# EasyEDA Pro project ProPrj_Dolphin 3D.epro, board PCB2
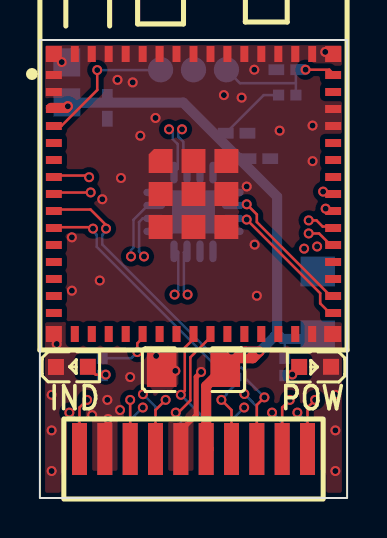
[diagram p5: board, top side]
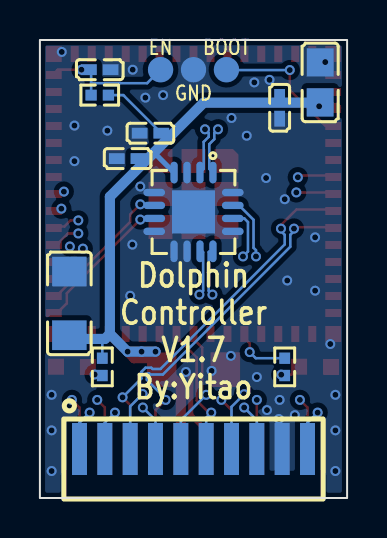
[diagram p6: board, bottom side, seen from below]

Outline 15.4 x 22.9 mm; copper layers: Top Layer, Inner1, Inner2, Bottom Layer. Coordinates in mm from the lower left corner of the outline.
Outline path: rectangle 0,22.9 15.4,0
Stack: Top Layer 0.035mm 外层铜厚1oz / Dielectric1 0.2133mm 7628 RC49% 8.6mil / Inner1 0.035mm 内层铜厚 / Dielectric2 0.2133mm 1.1mm H/HOZ 含铜 / Inner2 0.035mm 内层铜厚 / Dielectric3 0.2133mm 7628 RC49% 8.6mil / Bottom Layer 0.035mm 外层铜厚1oz

## Design rules (mm)
net D+: D
net D-: D
net M2B: M2
net M2A: M2
net M2EB: M2E
net M2EA: M2E
net M1A: M1
net M1B: M1
net M1EA: M1E
net M1EB: M1E
net VM1-: VM1
net VM1+: VM1
net VM2-: VM2
net VM2+: VM2
net VB-: VB
net VB+: VB
template: 自定义配置
spacing copperThickness1oz (default): track to track 0.102, other pairs 0 to 0.3
spacing copperThickness2oz: track to track 0.203, other pairs 0.152 to 0.3
track width copperThickness1oz (default): min 0.127, default 0.254, max 2.54
track width copperThickness2oz: min 0.203, default 0.254, max 2.54
differential pair differentialPair (default): width min 0.127, default 0.254, max 2.54; gap min 0.152, default 0.152
via viaSize (default): diameter min 0.5, default 0.61, max 10; hole min 0.3, default 0.305, max 6.299

## Placement (name value [footprint] x y rotation side)
C6  100uF  [C1206]  7.7 6.42 0 top
C7  22uF  [C0805]  1.35 20.78 270 bottom
C8  100nF  [C0402]  3.38 19.51 90 bottom
C16  1uF  [C0402]  12.4 21.42 180 bottom
C17  100nF  [C0402]  11 16.97 180 bottom
C18  1uF  [C0402]  9.86 18.24 180 bottom
C19  100uF  [C1206]  13.92 9.73 270 bottom
H1  KH-1.27PH180-2X10P-L7.2  [KH-1.27PH180-2X10P-L7.2 夹板]  7.7 2.45 180 bottom
LED1  KT-0603R  [LED0603-RD]  13.8 6.56 180 top
LED2  KT-0603W  [LED0603-RD]  1.6 6.56 0 top
NOREF  -  [Pad_e1005]  7.7 21.42 0 top
R3  1kΩ  [R0402]  12.4 20.14 180 bottom
R8  1kΩ  [R0402]  12.27 6.56 90 bottom
R9  1kΩ  [R0402]  3.13 6.56 90 bottom
TP1  -  [test-point-0.5mm]  6.05 21.42 0 top
TP2  -  [test-point-0.5mm]  9.35 21.42 0 top
U1  2.4GHz  [WIFI-SMD_ESP32-MINI-1-N4]  7.7 15.2 0 top
U7  INA3221AIRGVR  [QFN-16_L4.0-W4.0-P0.65-TL-EP2.2]  7.7 14.3 270 bottom

## Footprints (pads in the part's own frame, mm; a bottom-side part is the same pattern mirrored in y, then rotated)
C0402
  rect 0.79x0.54 smd: 1(-0.545,0) 2(0.545,0)
C0805
  rect 1.41x1.35 smd: 1(-1,0) 2(1,0)
C1206
  rect 1.485x1.728 smd: 1(-1.593,0) 2(1.593,0)
KH-1.27PH180-2X10P-L7.2 夹板
  rect 0.75x2.6 smd: 1(-5.715,0) 3(-4.445,0) 5(-3.175,0) 7(-1.905,0) 9(-0.635,0) 11(0.635,0) 13(1.905,0) 15(3.175,0) 17(4.445,0) 19(5.715,0)
  rect 0.75x2.6 smd far side: 2(-5.715,0) 4(-4.445,0) 6(-3.175,0) 8(-1.905,0) 10(-0.635,0) 12(0.635,0) 14(1.905,0) 16(3.175,0) 18(4.445,0) 20(5.715,0)
LED0603-RD
  rect 0.8x0.8 smd: 1(-0.799,-0.004) 2(0.799,0.004)
Pad_e1005
  round 1.27 smd far side: TP1(0,0)
QFN-16_L4.0-W4.0-P0.65-TL-EP2.2
  oval 1.087x0.364 smd: 1(-1.968,0.975) 2(-1.968,0.325) 3(-1.968,-0.325) 4(-1.968,-0.975) 9(1.968,-0.975) 10(1.968,-0.325) 11(1.968,0.325) 12(1.968,0.975)
  oval 0.364x1.087 smd: 5(-0.975,-1.968) 6(-0.325,-1.968) 7(0.325,-1.968) 8(0.975,-1.968) 13(0.975,1.968) 14(0.325,1.968) 15(-0.325,1.968) 16(-0.975,1.968)
  rect 2.16x2.16 smd: 17(0,0)
R0402
  rect 0.566x0.54 smd: 1(-0.433,0) 2(0.433,0)
test-point-0.5mm
  round 1.27 smd far side: 1(0,0)
WIFI-SMD_ESP32-MINI-1-N4
  rect 0.8x0.4 smd: 1(-7,5.95) 2(-7,5.1) 3(-7,4.25) 4(-7,3.4) 5(-7,2.55) 6(-7,1.7) 7(-7,0.85) 8(-7,0.001) 9(-7,-0.85) 10(-7,-1.7) 11(-7,-2.55) 12(-7,-3.4) 13(-7,-4.25) 14(-7,-5.1) 15(-7,-5.949) 31(7,-5.95) 32(7,-5.1) 33(7,-4.25) 34(7,-3.4) 35(7,-2.55) 36(7,-1.7) 37(7,-0.85) 38(7,-0.001) 39(7,0.85) 40(7,1.7) 41(7,2.55) 42(7,3.4) 43(7,4.25) 44(7,5.1) 45(7,5.949)
  rect 0.4x0.8 smd: 16(-5.95,-7) 17(-5.1,-7) 18(-4.25,-7) 19(-3.4,-7) 20(-2.55,-7) 21(-1.7,-7) 22(-0.85,-7) 23(-0.001,-7) 24(0.85,-7) 25(1.7,-7) 26(2.55,-7) 27(3.4,-7) 28(4.25,-7) 29(5.1,-7) 30(5.949,-7) 46(5.95,7) 47(5.1,7) 48(4.25,7) 49(3.4,7) 50(2.55,7) 51(1.7,7) 52(0.85,7) 53(0,7) 54(-0.85,7) 55(-1.7,7) 56(-2.55,7) 57(-3.4,7) 58(-4.25,7) 59(-5.1,7) 60(-5.95,7)
  custom 1.2x1.2 smd: 61(-1.65,1.65)
  rect 1.2x1.2 smd: 61(-1.65,0) 61(-1.65,-1.65) 61(0,1.65) 61(0,0) 61(0,-1.65) 61(1.649,-1.65) 61(1.65,1.65) 61(1.65,0)
  rect 0.8x0.8 smd: 62(-7,7) 63(-7,-7) 65(7,7)
  rect 0.85x0.8 smd: 64(6.975,-7)

## Nets
As in the schematic, except:
GND: C6.1 C7.1 C8.1 C16.2 C17.1 C18.1 C19.1 H1.12 H1.17 H1.18 LED1.1 LED2.1 NOREF.TP1 U1.1 U1.2 U1.30 U1.42 U1.43 U1.46 U1.47 U1.48 U1.49 U1.50 U1.51 U1.52 U1.53 U1.54 U1.55 U1.56 U1.57 U1.58 U1.59 U1.60 U1.61 U1.62 U1.63 U1.64 U1.65 U7.3 U7.5 U7.8 U7.9 U7.10 U7.13 U7.16 U7.17

Pads without a net: U1 6 11 12 13 14 15 16 17 18 19 21 22 25 26 27 28 29 33 34 39 40 41 44

## Via types
v1: diameter 0.5, hole 0.3, Top Layer to Bottom Layer, 78 vias

## Routing (per net, layer and track width the routed paths; a pad name or vN(x,y) marks a point on that pad's centre or on a via; arc(x,y) is an arc through that point)
+3V3: length 38.5
  Top Layer w0.508: 8.46,2.45 8.33,2.58 8.33,5.6 9.73,6.99 10.67,6.99 v1(11,7.32) v1(10.3,7.32) v1(9.6,7.32) ; 0.55,19.5 1.32,19.5 v1(1.4,19.59)
  Bottom Layer w0.127: R8.2 12.27,7.83 12.14,7.95 ; C18.2 11.22,20.14 R3.2
  Bottom Layer w0.254: 9.73,17.22 9.63,17.22 U7.4
  Bottom Layer w0.508: v1(9.6,7.32) v1(10.3,7.32) v1(11,7.32) 11.89,8.21 ; 11.89,8.21 12.14,7.95 13.47,7.95 ; 11.89,8.21 11.89,15.06 9.73,17.22 9.73,17.22 9.73,17.22 7.19,19.77 1.58,19.77 v1(1.4,19.59)
GND: length 4.3
  Top Layer w0.254: H1.12 7.06,3.38 7.83,4.14 7.83,6.06 v1(8.08,6.3)
  vias: v1(0.59,5.16) v1(0.59,3.38) v1(0.59,1.35) v1(0.84,7.7) v1(1.1,21.8) v1(1.6,13.03) v1(1.6,10.37) v1(2.62,4.14) v1(3,10.87) v1(3.13,14.94) v1(3.38,4.91) v1(3.42,3.95) v1(3.89,20.91) v1(4.02,4.4) v1(4.06,16) v1(4.52,6.05) v1(4.65,20.78) v1(5.03,18.11) v1(5.79,19) v1(5.83,7.11) v1(6.79,6.36) v1(9.22,20.14) v1(10.11,20.02) v1(10.37,15.57) v1(10.75,21.42) v1(10.76,12.67) v1(10.88,10.11) v1(12.02,18.37) v1(13.67,18.62) v1(13.67,16.84) v1(14.3,22.3) v1(14.81,5.16) v1(14.81,3.38) v1(14.81,1.35)
BOOT: length 7.1
  Top Layer w0.127: v1(2.87,21.4) 2.87,20.4 1.1,18.62 0.75,18.62 0.7,18.67
  Bottom Layer w0.127: v1(2.87,21.4) 6.03,21.4 TP1.1
D+: length 6.7
  Top Layer w0.127: 8.55,8.27 8.55,8.04 7.54,7.03 7.54,4.87 6.94,4.27 v1(6.81,4.27)
  Bottom Layer w0.127: H1.11 7.06,4.02 v1(6.81,4.27)
D-: length 6.7
  Top Layer w0.127: v1(7.06,5.16) 7.26,5.36 7.26,7.52 7.7,7.95 7.7,8.33
  Bottom Layer w0.127: H1.9 8.33,3.89 v1(7.06,5.16)
EN: length 6.5
  Top Layer w0.127: 14.7,21.22 14.51,21.42 v1(13.32,21.42)
  Bottom Layer w0.127: R3.1 12.83,20.74 ; 12.83,20.74 12.83,21.3 C16.1 ; 12.83,20.74 10.03,20.74 TP2.1
LED: length 2.9
  Top Layer w0.127: U1.20 5.15,8 4.88,7.73 v1(4.88,7.3)
  Bottom Layer w0.127: R9.2 4.58,6.99 v1(4.88,7.3)
M1A: length 17.5
  Top Layer w0.127: H1.14 5.79,4.4 v1(6.3,4.91) ; 0.7,16.12 2.38,16.12 v1(2.47,16.04)
  Inner2 w0.127: v1(2.47,16.04) 3.08,16.04 4.1,15.02 4.1,7.42 6.3,5.22 v1(6.3,4.91)
M1B: length 16.2
  Top Layer w0.127: 0.7,15.27 2.54,15.27 v1(2.55,15.28) ; v1(4.52,4.91) H1.16
  Inner2 w0.127: v1(4.52,4.91) 3.82,5.61 3.82,14.9 3.28,15.45 2.71,15.45 v1(2.55,15.28)
M1EA: length 18.3
  Top Layer w0.127: 0.7,14.42 2.54,14.42 3.31,13.65 v1(3.31,13.47) ; v1(11.26,5.03) 10.88,4.65 H1.6
  Bottom Layer w0.127: v1(3.31,13.47) 3.31,13.35 3.13,13.16 3.13,12.68 9.35,6.45 9.75,6.45 9.81,6.51 10.11,6.51 10.32,6.3 10.32,5.97 v1(11.26,5.03)
M1EB: length 17.1
  Top Layer w0.127: H1.8 9.6,4.4 v1(9.1,4.91) ; 0.76,13.54 2.59,13.54 v1(2.66,13.47)
  Bottom Layer w0.127: v1(2.66,13.47) 2.66,13.35 2.85,13.16 2.85,12.56 9.24,6.17 9.87,6.17 9.93,6.23 9.99,6.23 10.04,6.19 10.04,5.91 9.35,5.22 9.35,5.16 v1(9.1,4.91)
M2A: length 14.1
  Inner1 w0.127: v1(13.9,12.57) 14.09,12.38 14.09,9.23 10.72,5.86 10.72,5 v1(10.24,4.52)
  Inner2 w0.127: v1(14.32,14.47) 14.32,13 v1(13.9,12.57)
  Bottom Layer w0.127: v1(10.24,4.52) 9.6,3.89 H1.7
M2B: length 15.5
  Inner1 w0.127: v1(13.24,12.47) 13.81,11.9 13.81,9.35 10.25,5.79 v1(10.25,5.2)
  Inner2 w0.127: v1(13.24,12.47) 12.91,12.81 12.91,13.97 14.2,15.26 v1(14.2,15.32)
  Bottom Layer w0.127: v1(10.25,5.2) 10.88,4.58 H1.5
M2EA: length 16.3
  Top Layer w0.127: 14.7,12.72 14.5,12.72 14,13.23 v1(13.47,13.23)
  Inner1 w0.127: v1(5.16,4.52) 5.64,5 5.64,5.86 13.19,13.41 13.29,13.41 v1(13.47,13.23)
  Bottom Layer w0.127: v1(5.16,4.52) 4.52,3.89 H1.15
M2EB: length 16.6
  Top Layer w0.127: 14.7,13.57 14.17,13.57 13.87,13.88 v1(13.47,13.88)
  Inner1 w0.127: v1(13.47,13.88) 13.29,13.69 13.07,13.69 5.36,5.98 5.36,5.8 5.16,5.6 v1(5.16,5.19)
  Bottom Layer w0.127: H1.13 5.79,4.56 v1(5.16,5.19)
SCL: length 6.4
  Top Layer w0.127: v1(10.37,14.68) 10.88,14.18 10.88,13.8 14.5,10.17 14.7,10.17
SDA: length 6.5
  Top Layer w0.127: 14.7,9.32 14.46,9.32 14.05,9.73 14.05,10.24 v1(10.37,13.92)
VB+: length 17.2
  Inner2 w0.127: v1(4.57,12.08) 4.75,11.89 4.75,11.12 9.3,6.57 10.96,6.57 11.89,5.64 11.89,4.52 v1(11.64,4.27)
  Bottom Layer w0.127: v1(11.64,4.27) 12.14,3.76 H1.3 ; U7.15 5.41,14.63 4.69,13.91 4.69,12.51 4.57,12.39 v1(4.57,12.08)
VB-: length 16.6
  Top Layer w0.127: v1(12.53,4.91) 12.14,4.52 H1.4
  Inner2 w0.127: v1(5.22,12.08) 5.03,11.89 5.03,11.23 9.41,6.85 11.07,6.85 12.17,5.76 12.17,5.58 12.53,5.22 v1(12.53,4.91)
  Bottom Layer w0.127: U7.14 5.15,13.98 4.97,13.8 4.97,12.33 v1(5.22,12.08)
VM1+: length 24.2
  Inner2 w0.127: v1(7.12,18.43) 6.96,18.6 6.94,18.6 8.08,19.74 8.47,19.74 9.62,18.59 9.62,12.76 13.16,9.22 13.16,4.52 v1(12.91,4.27)
  Bottom Layer w0.127: U7.2 7.19,16.46 7.19,17.81 6.94,18.06 6.94,18.25 v1(7.12,18.43) ; H1.1 13.41,3.76 v1(12.91,4.27)
VM1-: length 25.1
  Top Layer w0.127: v1(13.8,4.91) 13.41,4.52 H1.2
  Inner2 w0.127: v1(6.47,18.43) 6.66,18.62 6.66,18.71 7.97,20.02 8.59,20.02 9.9,18.71 9.9,12.87 13.44,9.34 13.44,5.58 13.8,5.22 v1(13.8,4.91)
  Bottom Layer w0.127: v1(6.47,18.43) 6.66,18.25 6.66,17.94 6.91,17.69 6.91,16.46 U7.1
VM2+: length 13.5
  Inner1 w0.127: v1(1.48,4.27) 1.48,5.22 1.78,5.52 1.78,5.7 4.18,8.11 5.54,8.11 6.94,9.5 6.94,9.98 v1(6.75,10.17)
  Bottom Layer w0.127: U7.12 6.89,12.33 6.94,12.29 6.94,10.36 v1(6.75,10.17) ; H1.19 1.98,3.76 v1(1.48,4.27)
VM2-: length 13.4
  Top Layer w0.127: v1(2.37,4.91) 1.98,4.52 H1.20
  Inner1 w0.127: v1(7.4,10.17) 7.22,9.98 7.22,9.39 5.66,7.83 4.3,7.83 2.06,5.59 2.06,5.52 2.37,5.22 v1(2.37,4.91)
  Bottom Layer w0.127: v1(7.4,10.17) 7.22,10.36 7.22,12.29 7.26,12.33 U7.11
$1N832:
  vias: v1(12.65,6.17)
$1N833: length 1.1
  Top Layer w0.127: LED2.2 2.8,6.17 v1(3.3,6.17)

## Copper pours and planes (outline as drawn; the poured copper is in the pictures)
GND on Top Layer: -9.19,30.31 19,30.31 19,-0.94 -9.19,-0.94
GND on Bottom Layer: -8.37,29.5 19.83,29.5 19.83,-1.74 -8.37,-1.74
GND on Inner1: -7.41,28.65 20.78,28.65 20.78,-2.59 -7.41,-2.59
GND on Inner2: -6.78,27.7 21.42,27.7 21.42,-3.54 -6.78,-3.54

## Text on the board
Bottom Silkscreen Layer: BOOT | GND | EN | Dolphin / Controller / V1.7 / By:Yitao
Top Silkscreen Layer: IND | POW
